# Altium schematic sheet nusense-otg_hs_usb.schdoc: NUSense
size A4; Organization: Elby Designs; Address1: 9 Follan Close; Address2: Kariong; Address3: NSW 2250; Address4: Australia; Revision: 1; SheetNumber: 3; SheetTotal: 9; DrawnBy: USB Section; Engineer: Laurie Biddulph; PageSetup: Record=PageOptions|CenterHorizontal=True|CenterVertical=True|PrintScale=1.38|XCorrection=1.00|YCorrection=1.00|PrintKind=1|BorderSize=5000000|LeftOffset=0|BottomOffset=0|Orientation=2|PaperLength=1000|PaperWidth=1000|Scale=100|PaperSource=7|PrintQuality=-4|MediaType=1|DitherType=10|PaperKind=A3|PrintScaleMode=1
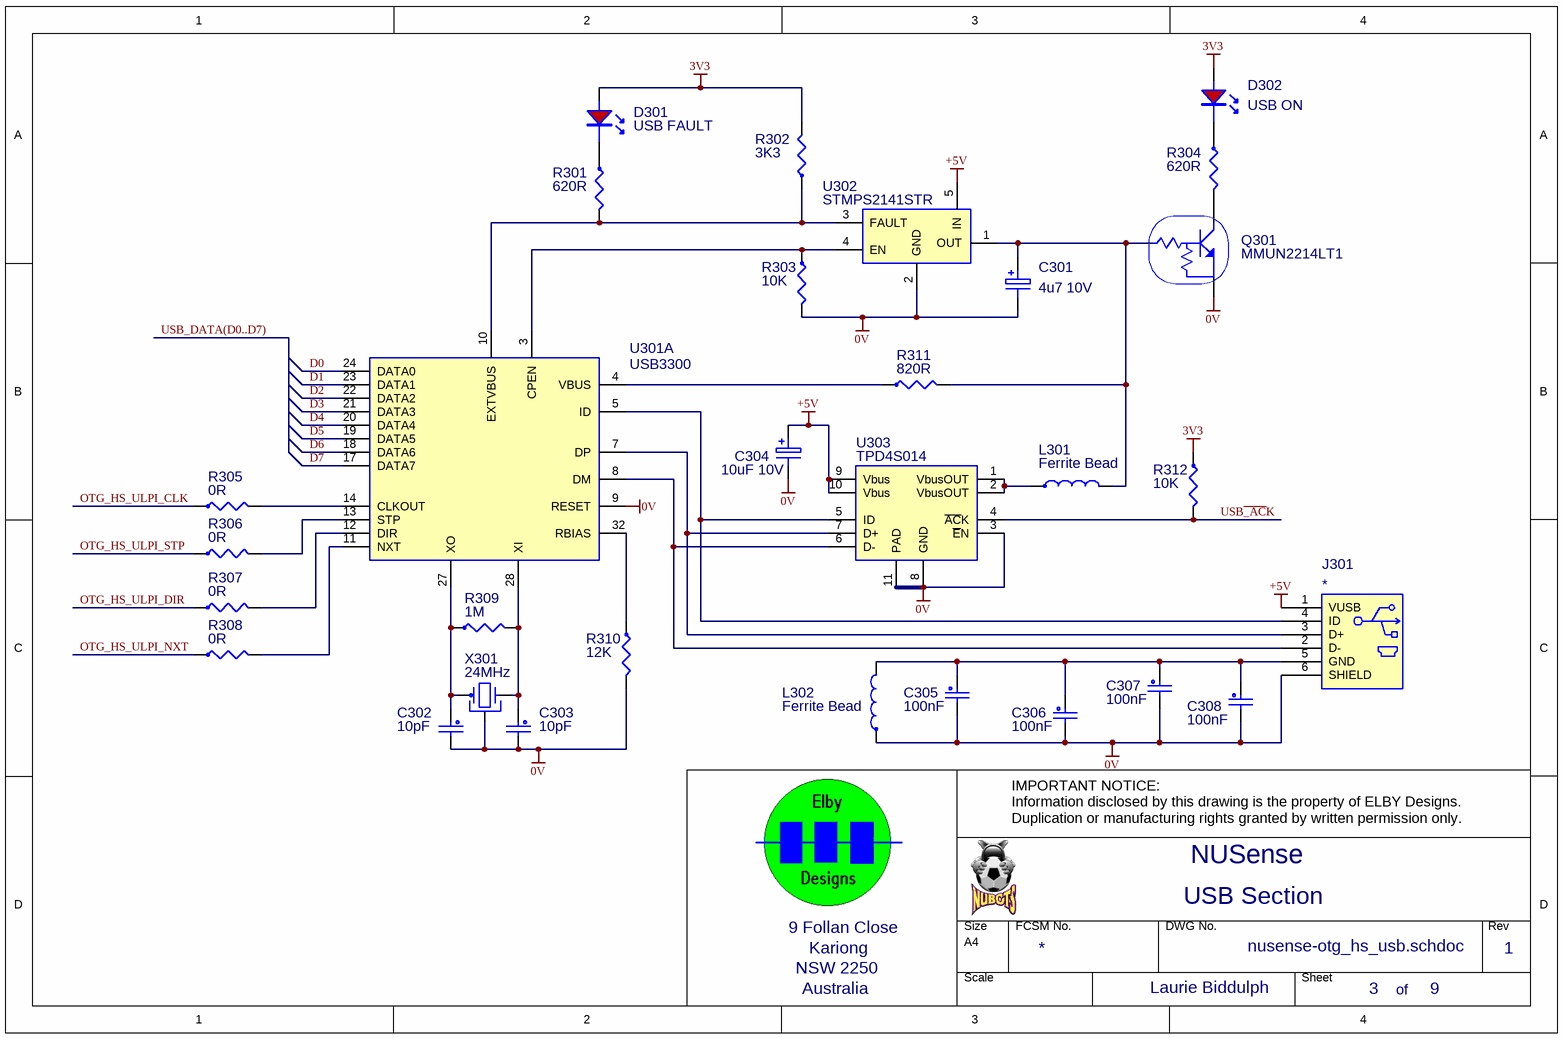
[diagram p0: nusense-otg_hs_usb.schdoc]

## Parts
C301  4u7 10V  [RB-D5.0-P2.0]
C302  10pF  [RAD-0.2N(LB)]
C303  10pF  [RAD-0.2N(LB)]
C304  10uF 10V  [RB-D6.3-P2.5]
C305  100nF  [RAD-0.2N(LB)]
C306  100nF  [RAD-0.2N(LB)]
C307  100nF  [RAD-0.2N(LB)]
C308  100nF  [RAD-0.2N(LB)]
D301  USB FAULT  [LED-PCB(LB)]
D302  USB ON  [LED-PCB(LB)]
J301  *
L301  Ferrite Bead  [AXIAL-0.3IND(LB)]
L302  Ferrite Bead  [AXIAL-0.3IND(LB)]
Q301  MMUN2214LT1  [SOT-23(LB)]
R301  620R  [AXIAL-0.4(LB)]
R302  3K3  [AXIAL-0.4(LB)]
R303  10K  [AXIAL-0.4(LB)]
R304  620R  [AXIAL-0.4(LB)]
R305  0R  [AXIAL-0.4(LB)]
R306  0R  [AXIAL-0.4(LB)]
R307  0R  [AXIAL-0.4(LB)]
R308  0R  [AXIAL-0.4(LB)]
R309  1M  [AXIAL-0.4(LB)]
R310  12K  [AXIAL-0.4(LB)]
R311  820R  [AXIAL-0.4(LB)]
R312  10K  [AXIAL-0.4(LB)]
U301  USB3300  [QFN-32_L]  (part A of 2)
U302  STMPS2141STR  [SOT-23-5(LB)]
U303  TPD4S014
X301  24MHz  [CRYSTAL-3(LB)]

## Nets
0V: C301.2 C302.2 C303.2 C304.2 C305.2 C306.2 C307.2 C308.2 J301.6(SHIELD) L302.1 Q301.2(E) R303.2 R310.2 U301.9(RESET) U302.2(GND) U303.3(~{E}N) U303.8(GND) U303.11(PAD) X301.3
3V3: D301.A D302.A R302.2 R312.1
+5V: C304.1 J301.1(VUSB) U302.5(IN) U303.9(Vbus) U303.10(Vbus)
D0: U301.24(DATA0)
D1: U301.23(DATA1)
D2: U301.22(DATA2)
D3: U301.21(DATA3)
D4: U301.20(DATA4)
D5: U301.19(DATA5)
D6: U301.18(DATA6)
D7: U301.17(DATA7)
OTG_HS_ULPI_CLK: R305.1
OTG_HS_ULPI_DIR: R307.1
OTG_HS_ULPI_NXT: R308.1
OTG_HS_ULPI_STP: R306.1
USB~{_AC}K: R312.2 U303.4(~{AC}K)
NetC301_1: C301.1 L301.2 Q301.1(B) R311.2 U302.1(OUT)
NetC302_1: C302.1 R309.1 U301.27(XO) X301.1
NetC303_1: C303.1 R309.2 U301.28(XI) X301.2
NetC305_1: C305.1 C306.1 C307.1 C308.1 J301.5(GND) L302.2
NetD301_K: D301.K R301.1
NetD302_K: D302.K R304.1
NetJ301_2: J301.2(D-) U301.8(DM) U303.6(D-)
NetJ301_3: J301.3(D+) U301.7(DP) U303.7(D+)
NetJ301_4: J301.4(ID) U301.5(ID) U303.5(ID)
NetL301_1: L301.1 U303.1(VbusOUT) U303.2(VbusOUT)
NetQ301_3: Q301.3(C) R304.2
NetR301_2: R301.2 R302.1 U301.10(EXTVBUS) U302.3(FAULT)
NetR303_1: R303.1 U301.3(CPEN) U302.4(EN)
NetR305_2: R305.2 U301.14(CLKOUT)
NetR306_2: R306.2 U301.13(STP)
NetR307_2: R307.2 U301.12(DIR)
NetR308_2: R308.2 U301.11(NXT)
NetR310_1: R310.1 U301.32(RBIAS)
NetR311_1: R311.1 U301.4(VBUS)

## Buses and harness runs
bus USB_DATA(D0..D7)

## Notes on the sheet
- IMPORTANT NOTICE:
  Information disclosed by this drawing is the property of ELBY Designs.
  Duplication or manufacturing rights granted by written permission only.
- of

## Library data of the parts
C301 = CE-4U7F50V(LB): 20% 50V Aluminium Electrolytic; EMRP: CE-4U7F
C302 C303 = CC-10PF(LB): NPO Low K, 50VDC Ceramic Disc; EMRP: CC-10PF
C304 = CE-10UF50V(LB): 20% 50V Aluminium Electrolytic; EMRP: CE-10UF
C305-C308 = CC-100NF(LB): Monolithic Ceramic; EMRP: CC-100NF
D301 D302 = LED-RED(LB): LED
J301 = ZX62D-B-5P8
L301 L302 = FERRITE-BEAD(LB): EMRP: IN-BEAD
Q301 = MMUN2214LT1(SMD): NPN Digital Transistor; EMRP: SM-T-MMUN2214LT1
R301 R304 = RM-620R(LB): 0.5W 1% Metal Film Resistor; EMRP: RM-620R
R302 = RM-3K3(LB): 0.5W 1% Metal Film Resistor; EMRP: RM-3K3
R303 R312 = RM-10K(LB): 0.5W 1% Metal Film Resistor; EMRP: RM-10K
R305-R308 = RM-SC(LB): Resistor - Short Circuit; EMRP: NA
R309 = RM-1M(LB): 0.5W 1% Metal Film Resistor; EMRP: RM-1M
R310 = RM-12K(LB): 0.5W 1% Metal Film Resistor; EMRP: RM-12K
R311 = RM-820R(LB): 0.5W 1% Metal Film Resistor; EMRP: RM-820R
U301 = USB3300: USB Host Controller
U302 = STMPS2141: Power Switch
U303 = TPD4S014: USB Charger Port Protector
X301 = XTAL-24MHZ(LB): 24MHz Parallel-cut Crystal - HC49; EMRP: ZT-20MHZ